# Altium project Bee-CC2540.PrjPcb
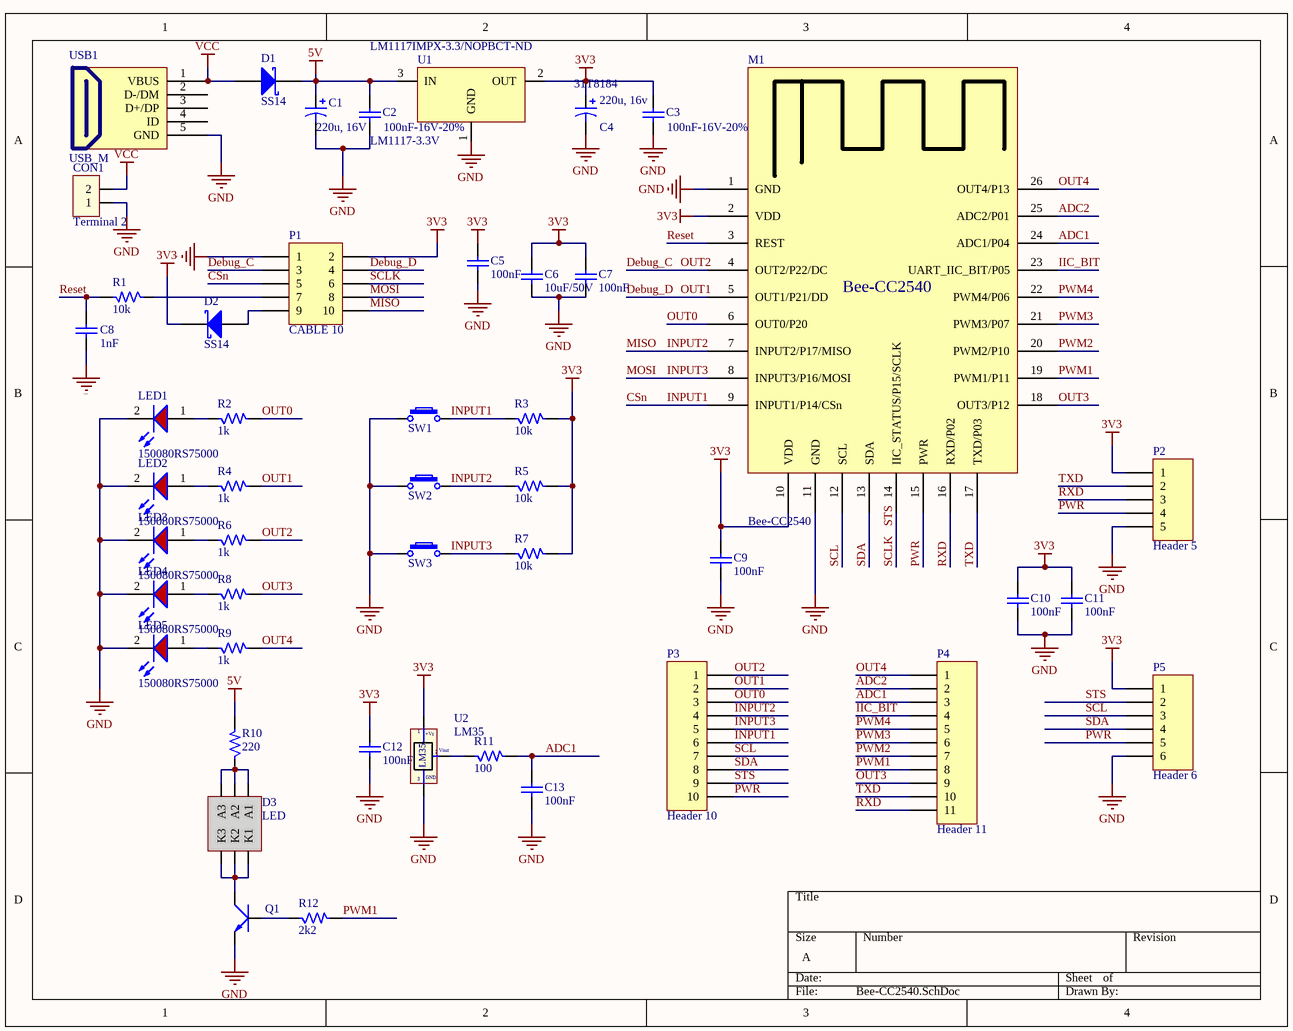
[diagram p0: Bee-CC2540.SchDoc]
1 sheet, 47 parts. Net scope: global (net labels, ports and power ports of the same name join across sheets).
Board file: Bee-CC2540.PcbDoc

## Sheet Bee-CC2540.SchDoc
size A

### Parts
C1  value 220u, 16V  [CAP TANTALUM 7343]  (hidden comment: Cap Pol3)
C2  100nF-16V-20%  [C0805]
C3  100nF-16V-20%  [C0805]
C4  220u, 16v  Supplier Part Number 1: 31T8184  [CAP TANTALUM 7343]
C5  100nF  [C0805]
C6  10uF/50V  [C1206]
C7  100nF  [C0805]
C8  1nF  [C0805]
C9  100nF  [C0805]
C10  100nF  [C0805]
C11  100nF  [C0805]
C12  100nF  [C0805]
C13  100nF  [C0805]
CON1  Terminal 2  [Terminal 2 5.08]
D1  SS14  [DO-214AC (SMA)]
D2  SS14  [DO-214AC (SMA)]
D3  LED  [LED5050]
LED1  150080RS75000  [LED_0805_Red]
LED2  150080RS75000  [LED_0805_Red]
LED3  150080RS75000  [LED_0805_Red]
LED4  150080RS75000  [LED_0805_Red]
LED5  150080RS75000  [LED_0805_Red]
M1  Bee-CC2540  [Bee-CC2540]
P1  CABLE 10  [CABLE 10]
P2  Header 5  [HDR1X5]
P3  Header 10  [HDR1X10]
P4  Header 11  [HDR1X11]
P5  Header 6  [HDR1X6]
Q1  C1815  [2SC1815]  (value not drawn)
R1  10k  [R0805]
R2  1k  [R0805]
R3  10k  [R0805]
R4  1k  [R0805]
R5  10k  [R0805]
R6  1k  [R0805]
R7  10k  [R0805]
R8  1k  [R0805]
R9  1k  [R0805]
R10  220  [R1206]
R11  100  [R0805]
R12  2k2  [R0805]
SW1  SW2  [SMD(2)]  (value not drawn)
SW2  SW2  [SMD(2)]  (value not drawn)
SW3  SW2  [SMD(2)]  (value not drawn)
U1  LM1117-3.3V  Supplier Part Number 1: LM1117IMPX-3.3/NOPBCT-ND  [LM1117-SOP]
U2  LM35  [QTO-92]
USB1  USB_M  [USB_B_MINI_SMD]

### Nets
3V3: C3.1 C4.1 C5.1 C6.1 C7.1 C9.1 C10.1 C11.1 C12.1 D2.2(K) M1.2(VDD) M1.10(VDD) P1.2 P2.1 P5.1 R3.2 R5.2 R7.2 U1.2(OUT) U2.1(+Vs)
5V: C1.1 C2.1 D1.2(K) R10.2 U1.3(IN)
GND: C1.2 C2.2 C3.2 C4.2 C5.2 C6.2 C7.2 C8.2 C9.2 C10.2 C11.2 C12.2 C13.2 CON1.1 LED1.2(C) LED2.2(C) LED3.2(C) LED4.2(C) LED5.2(C) M1.1(GND) M1.11(GND) P1.1 P2.5 P5.6 Q1.2(E) SW1.1 SW2.1 SW3.1 U1.1(GND) U2.3(-) USB1.5(GND)
VCC: CON1.2 D1.1(A) USB1.1(VBUS)
ADC1: C13.1 M1.24(ADC1/P04) P4.3 R11.2
ADC2: M1.25(ADC2/P01) P4.2
CSn: M1.9(INPUT1/P14/CSn) P1.5 P3.6 R3.1 SW1.2  [also labelled INPUT1]
Debug_C: M1.4(OUT2/P22/DC) P1.3 P3.1 R6.2  [also labelled OUT2]
Debug_D: M1.5(OUT1/P21/DD) P1.4 P3.2 R4.2  [also labelled OUT1]
IIC_BIT: M1.23(UART_IIC_BIT/P05) P4.4
INPUT2: M1.7(INPUT2/P17/MISO) P1.10 P3.4 R5.1 SW2.2  [also labelled MISO]
INPUT3: M1.8(INPUT3/P16/MOSI) P1.8 P3.5 R7.1 SW3.2  [also labelled MOSI]
OUT0: M1.6(OUT0/P20) P3.3 R2.2
OUT3: M1.18(OUT3/P12) P4.9 R8.2
OUT4: M1.26(OUT4/P13) P4.1 R9.2
PWM1: M1.19(PWM1/P11) P4.8 R12.2
PWM2: M1.20(PWM2/P10) P4.7
PWM3: M1.21(PWM3/P07) P4.6
PWM4: M1.22(PWM4/P06) P4.5
PWR: M1.15(PWR) P2.4 P3.10 P5.5
Reset: C8.1 M1.3(REST) R1.2
RXD: M1.16(RXD/P02) P2.3 P4.11
SCL: M1.12(SCL) P3.7 P5.3
SCLK: M1.14(IIC_STATUS/P15/SCLK) P1.6 P3.9 P5.2  [also labelled STS]
SDA: M1.13(SDA) P3.8 P5.4
TXD: M1.17(TXD/P03) P2.2 P4.10
NetD2_1: D2.1(A) P1.9
NetD3_1: D3.1(A1) D3.3(A2) D3.5(A3) R10.1
NetD3_2: D3.2(K1) D3.4(K2) D3.6(K3) Q1.3(C)
NetLED1_1: LED1.1(A) R2.1
NetLED2_1: LED2.1(A) R4.1
NetLED3_1: LED3.1(A) R6.1
NetLED4_1: LED4.1(A) R8.1
NetLED5_1: LED5.1(A) R9.1
NetP1_7: P1.7 R1.1
NetQ1_1: Q1.1(B) R12.1
NetR11_1: R11.1 U2.2(Vout)

Not connected (* = marked no-connect by the designer): USB1 2(D-/DM) 3(D+/DP) 4(ID)

### Notes on the sheet
- (in symbol LM35) GND

### Library data of the parts
C1 = Cap Pol3: Polarized Capacitor (Surface Mount); Manufacturer: Kemet; Manufacturer Part Number: C0603C103K5RACTU; Capacitance: 10000pF; Voltage - Rated: 50V; Tolerance: ±10%; Temperature Coefficient: X7R; Published: 8-Jun-2000; LatestRevisionDate: 29-May-2009; LatestRevisionNote: IPC-7351 Footprint Added.; PackageReference: C0805; Publisher: Altium Limited; PackageDescription: Chip Capacitor; Supplier 1: Digi-Key; Supplier Part Number 1: 399-1091-1-ND; RoHS: RoHS Compliant; Category: Capacitors; Stock 1: 1592048; Pricing 1: 1=0.1, 10=0.019, 50=0.0104, 100=0.0088, 250=0.0072, 500=0.00616, 1000=0.0048 (USD); Packaging: Cut Tape (CT); Mounting Type: Surface Mount, MLCC; Operating Temperature: -55°C ~ 125°C; Applications: General Purpose; Ratings: -; Package/Case: 0603 (1608 Metric); Size / Dimension: 0.063" L x 0.031" W (1.60mm x 0.80mm); Height - Seated (Max): -; Thickness (Max): 0.034" (0.87mm); Lead Spacing: -; Features: -; Lead Style: -; ComponentLink1URL: http://www.kemet.com/datasheets&C0603C103K5RACTU; ComponentLink1Description: http://www.kemet.com/datasheets&C0603C103K5RACTU; Supplier 2: Digi-Key; Supplier Part Number 2: 587-2994-1-ND; Stock 2: 102954; Pricing 2: 1=0.28, 10=0.19, 50=0.115, 100=0.0966, 250=0.0782, 500=0.069, 1000=0.05865 (USD); ComponentLink2URL: http://www.yuden.co.jp/or/product/category/capacitor/UMK316AB7475KL-T.pdf; ComponentLink2Description: http://www.yuden.co.jp/or/product/category/capacitor/UMK316AB7475KL-T.pdf
C2 C3 C5 C7-C13 = Cap: CAP CER 0.1UF 16V Y5V 0603; Manufacturer: Yageo; Manufacturer Part Number: CC0603ZRY5V7BB104; Published: 8-Jun-2000; LatestRevisionDate: 17-Jul-2002; LatestRevisionNote: Re-released for DXP Platform.; PackageReference: C0603; Publisher: Altium Limited; Digi-Key Part Number: 311-1369-1-ND; Unit Price: 0.00648
  C2 C3: Value: 100nF-16V-20%
  C5 C7 C9-C13: Value: 100nF
  C8: Value: 1nF
C4 = Cap Pol3: Polarized Capacitor (Surface Mount); Published: 8-Jun-2000; LatestRevisionDate: 29-May-2009; LatestRevisionNote: IPC-7351 Footprint Added.; PackageReference: C0805; Publisher: Altium Limited; PackageDescription: Chip Capacitor; Supplier 1: Newark
C6 = Cap Semi: Capacitor 100n 16V 0603; Published: 8-Jun-2000; LatestRevisionDate: 29-May-2009; LatestRevisionNote: IPC-7351 Footprint Added.; PackageReference: C1206; Publisher: Altium Limited; PackageDescription: Chip Capacitor
CON1 = Terminal 2: Value: Connector 2
D1 D2 = D Schottky: Schottky Diode; Published: 8-Jun-2000; LatestRevisionDate: 17-Jul-2002; LatestRevisionNote: Re-released for DXP Platform.; PackageReference: SMB; Publisher: Altium Limited; Code_JEDEC: DO-214-AA
D3 = LED5050
LED1-LED5 = led-0805: SMD mono-color Chip LED, WL-SMCW, Red; Manufacturer: W黵th Elektronik eiSos GmbH; PartNo: 150080RS75000; ComponentLink1Description: Manufacturer; ComponentLink1URL: http://www.we-online.de; Created by: Christin Otto; Created Date: June 2013; ComponentLink2Description: Datasheet; ComponentLink2URL: http://katalog.we-online.com/led/datasheet/150080RS75000.pdf; Color: Red
P1 = CABLE 10: Header, 5-Pin, Dual row; LatestRevisionDate: 17-Jul-2002; LatestRevisionNote: Re-released for DXP Platform.; Publisher: Altium Limited
P2 = Header 5: Header, 5-Pin; LatestRevisionDate: 17-Jul-2002; LatestRevisionNote: Re-released for DXP Platform.; Publisher: Altium Limited
P3 = Header 10: Header, 10-Pin; LatestRevisionDate: 17-Jul-2002; LatestRevisionNote: Re-released for DXP Platform.; Publisher: Altium Limited
P4 = Header 11: Header, 11-Pin; LatestRevisionDate: 17-Jul-2002; LatestRevisionNote: Re-released for DXP Platform.; Publisher: Altium Limited
P5 = Header 6: Header, 6-Pin; LatestRevisionDate: 17-Jul-2002; LatestRevisionNote: Re-released for DXP Platform.; Publisher: Altium Limited
Q1 = C1815: NPN SMD Transistor; Manufacturer No: 2SC1815-HF; Manufacturer: Toshiba; Vendor: BL Galaxy Electrical; Vendor_Vietnam: TME; Value: C1815; Specification: C1815
R1-R12 = RM: Resistor SMD; Manufacturer No: RM10JTN102; Manufacturer: UniOhm; Power Rating: 1/10W; Specification: ="Value" + "  "+ "Power Rating"
  R1 R3 R5 R7: Value: 10k
  R2 R4 R6 R8 R9: Value: 1k
  R10: Value: 220
  R11: Value: 100
  R12: Value: 2k2
U1 = LM1117: 800mA Low-Dropout Linear Regulator; Creator: Nguyen Ba Bien; Website: http://group3i.net; Supplier 1: Digi-Key
U2 = LM35: Teminal; Value: LM35